# EAGLE design Fonte (EAGLE 9.4.1)
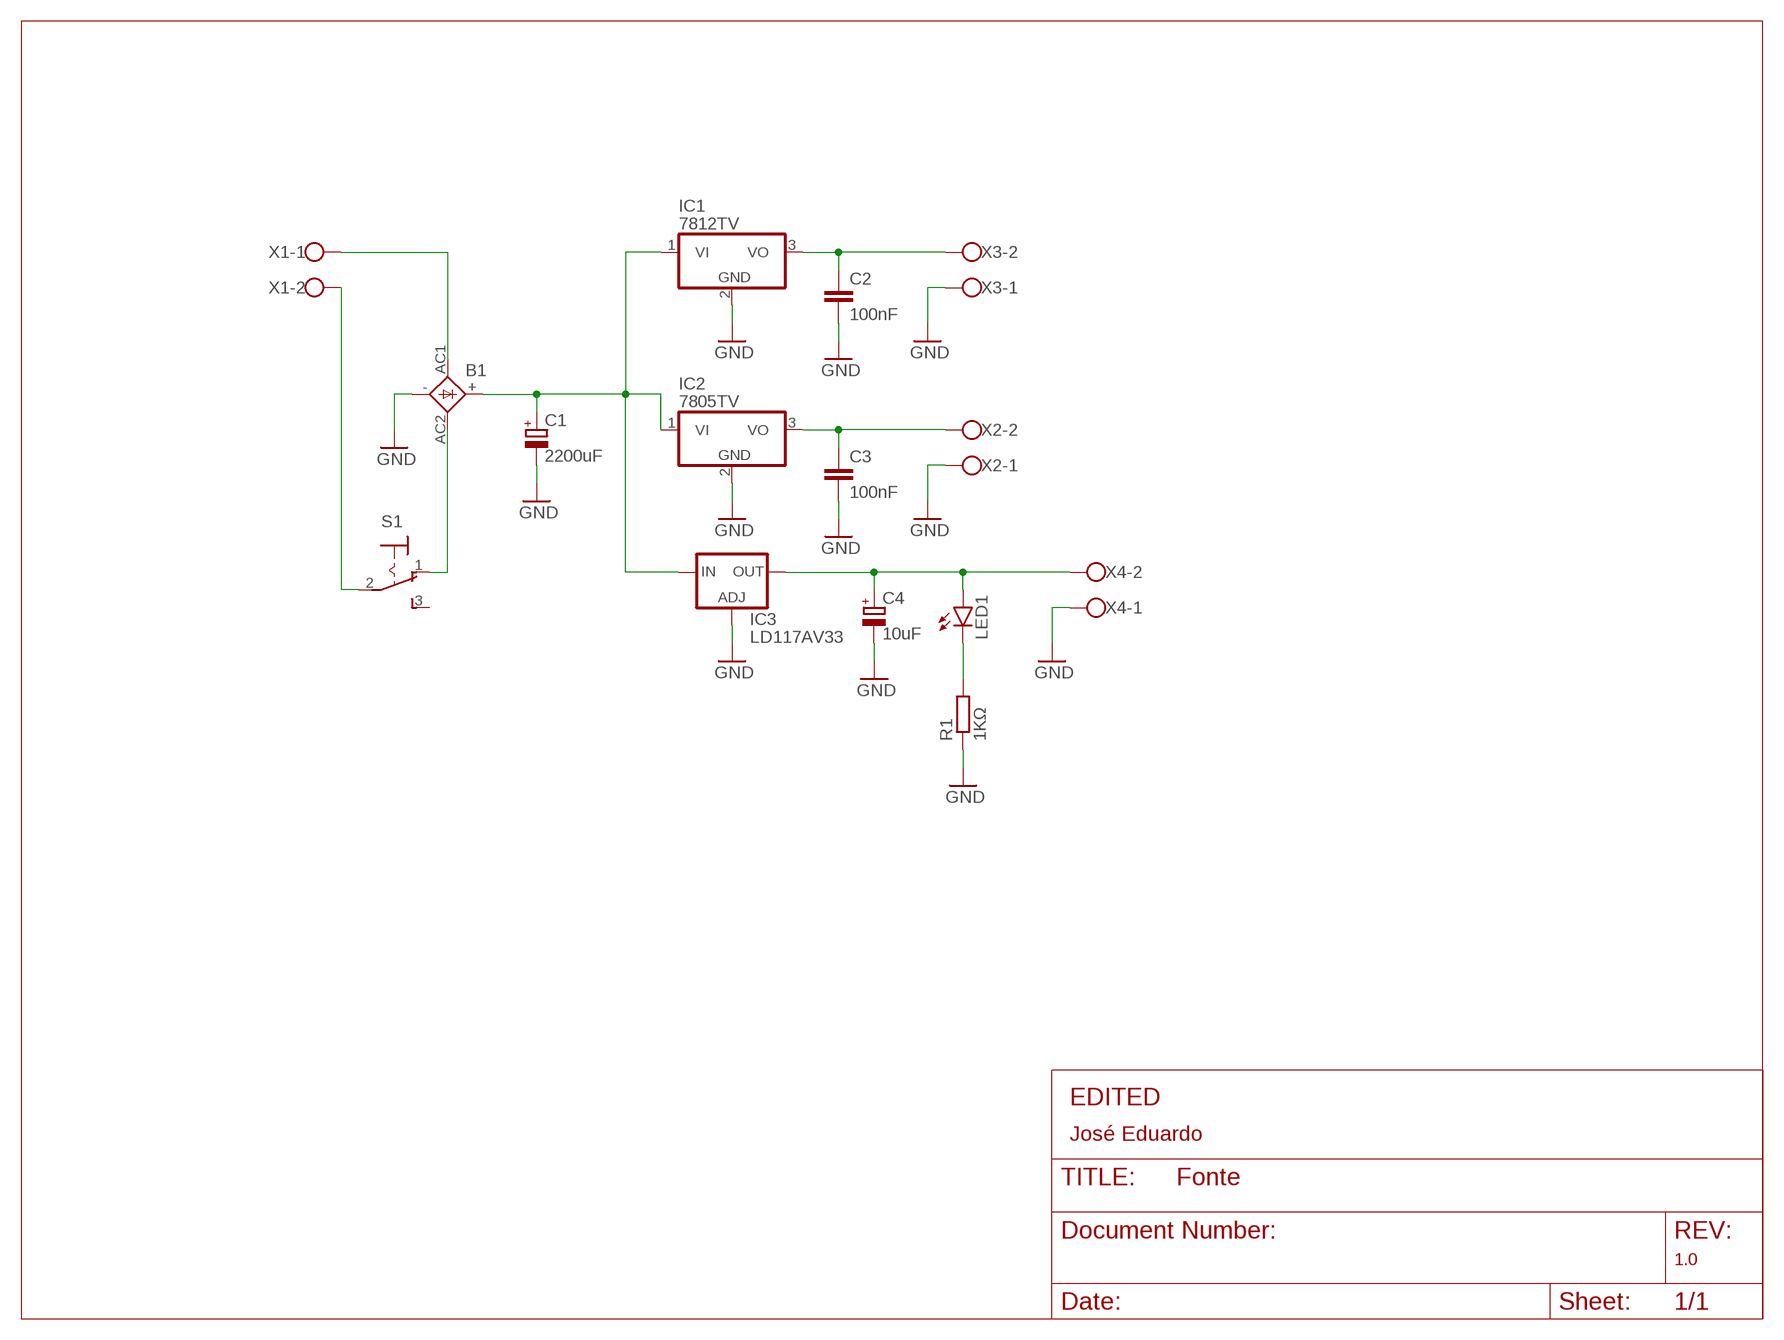
[diagram p0: schematic, sheet 1]
FRAME1 (LETTER_L): EDIT: José Eduardo; REV: 1.0

## Parts
B1  2KBB  [2KBB]
C1  2200uF  CPOL-EUE5-13  [E5-13]
C2  100nF  C-EU025-024X044  [C025-024X044]
C3  100nF  C-EU025-024X044  [C025-024X044]
C4  10uF  CPOL-EUE1.8-4  [E1,8-4]
IC1  7812TV  [TO220V]
IC2  7805TV  [TO220V]
IC3  LD117AV33  [TO220S]
LED1  LED5MM  [LED5MM]
R1  1KΩ  R-EU_0207/10  [0207/10]
S1  M9040P  [M9040P]
X1  W237-102  [W237-102]
X2  W237-102  [W237-102]
X3  W237-102  [W237-102]
X4  W237-102  [W237-102]

## Nets
3.3V: C4.+ IC3.2(OUT) LED1.A X4.2
5V: C2.1 IC1.3(VO) X3.2
12V: C3.1 IC2.3(VO) X2.2
AC1: B1.AC1 X1.1
AC2: S1.2(P) X1.2
CHAVE: B1.AC2 S1.1(O)
GND: B1.- C1.- C2.2 C3.2 C4.- IC1.2(GND) IC2.2(GND) IC3.1(ADJ) R1.1 X2.1 X3.1 X4.1
LED: LED1.K(C) R1.2
MAIN: B1.+ C1.+ IC1.1(VI) IC2.1(VI) IC3.3(IN)
Unconnected: S1.3(S)

## Library data of the parts
B1 = rectifier:2KBB: RECTIFIER grid 3 x 5 mm
C1 = resistor:CPOL-EU: POLARIZED CAPACITOR, European symbol
C2 C3 = rcl:C-EU: CAPACITOR, European symbol; SPICEPREFIX: C
C4 = rcl:CPOL-EU: POLARIZED CAPACITOR, European symbol; SPICEPREFIX: C
IC1 IC2 = linear:78*: Positive VOLTAGE REGULATOR Source: http://cache.national.com/ds/LM/LM78L05.pdf http://www.fairchildsemi.com/ds/LM/LM7805.pdf
IC3 = v-reg:LD117A?*: Low drop fixed and adjustable positive voltage regulators 1 A Source: http://www.st.com/stonline/products/literature/ds/7194/ld1117axx.pdf
LED1 = led:LED: LED OSRAM: - CHIPLED LG R971, LG N971, LY N971, LG Q971, LY Q971, LO R971, LY R971 LH N974, LH R974 LS Q976, LO Q976, LY Q976 LO Q996 - Hyper CHIPLED LW Q18S LB Q993, LB Q99A, LB R99A - SideLED LS A670, LO A670, LY A670, LG A670, LP A670 LB A673, LV A673, LT A673, LW A673 LH A674 LY A675 LS A676, LA A676, LO A676, LY A676, LW A676 LS A679, LY A679, LG A679 - Hyper Micro SIDELED® LS Y876, LA Y876, LO Y876, LY Y876 LT Y87S - SmartLED LW L88C, LW L88S LB L89C, LB L89S, LG L890 LS L89K, LO L89K, LY L89K LS L896, LA L896, LO L896, LY L896 - TOPLED LS T670, LO T670, LY T670, LG T670, LP T670 LSG T670, LSP T670, LSY T670, LOP T670, LYG T670 LG T671, LOG T671, LSG T671 LB T673, LV T673, LT T673, LW T673 LH T674 LS T676, LA T676, LO T676, LY T676, LB T676, LH T676, LSB T676, LW T676 LB T67C, LV T67C, LT T67C, LS T67K, LO T67K, LY T67K, LW E67C LS E67B, LA E67B, LO E67B, LY E67B, LB E67C, LV E67C, LT E67C LW T67C LS T679, LY T679, LG T679 LS T770, LO T770, LY T770, LG T770, LP T770 LB T773, LV T773, LT T773, LW T773 LH T774 LS E675, LA E675, LY E675, LS T675 LS T776, LA T776, LO T776, LY T776, LB T776 LHGB T686 LT T68C, LB T68C - Hyper Mini TOPLED® LB M676 - Mini TOPLED Santana® LG M470 LS M47K, LO M47K, LY M47K Source: http://www.osram.convergy.de LUXEON: - LUMILED® LXK2-PW12-R00, LXK2-PW12-S00, LXK2-PW14-U00, LXK2-PW14-V00 LXK2-PM12-R00, LXK2-PM12-S00, LXK2-PM14-U00 LXK2-PE12-Q00, LXK2-PE12-R00, LXK2-PE12-S00, LXK2-PE14-T00, LXK2-PE14-U00 LXK2-PB12-K00, LXK2-PB12-L00, LXK2-PB12-M00, LXK2-PB14-N00, LXK2-PB14-P00, LXK2-PB14-Q00 LXK2-PR12-L00, LXK2-PR12-M00, LXK2-PR14-Q00, LXK2-PR14-R00 LXK2-PD12-Q00, LXK2-PD12-R00, LXK2-PD12-S00 LXK2-PH12-R00, LXK2-PH12-S00 LXK2-PL12-P00, LXK2-PL12-Q00, LXK2-PL12-R00 Source: www.luxeon.com KINGBRIGHT: KA-3528ASYC Source: www.kingbright.com
R1 = rcl:R-EU_: RESISTOR, European symbol; SPICEPREFIX: R
S1 = switch:M9040P: TOGGLE SWITCH Marquardt
X1-X4 = con-wago-500:W237-102: WAGO SCREW CLAMP; MPN: 237-102; OC_FARNELL: unknown; OC_NEWARK: 70K9898

## Net classes
0 MAIN: width 0.61 mm, clearance 0.61 mm
1 GENERIC: width 0.66 mm, clearance 0.66 mm

## Board
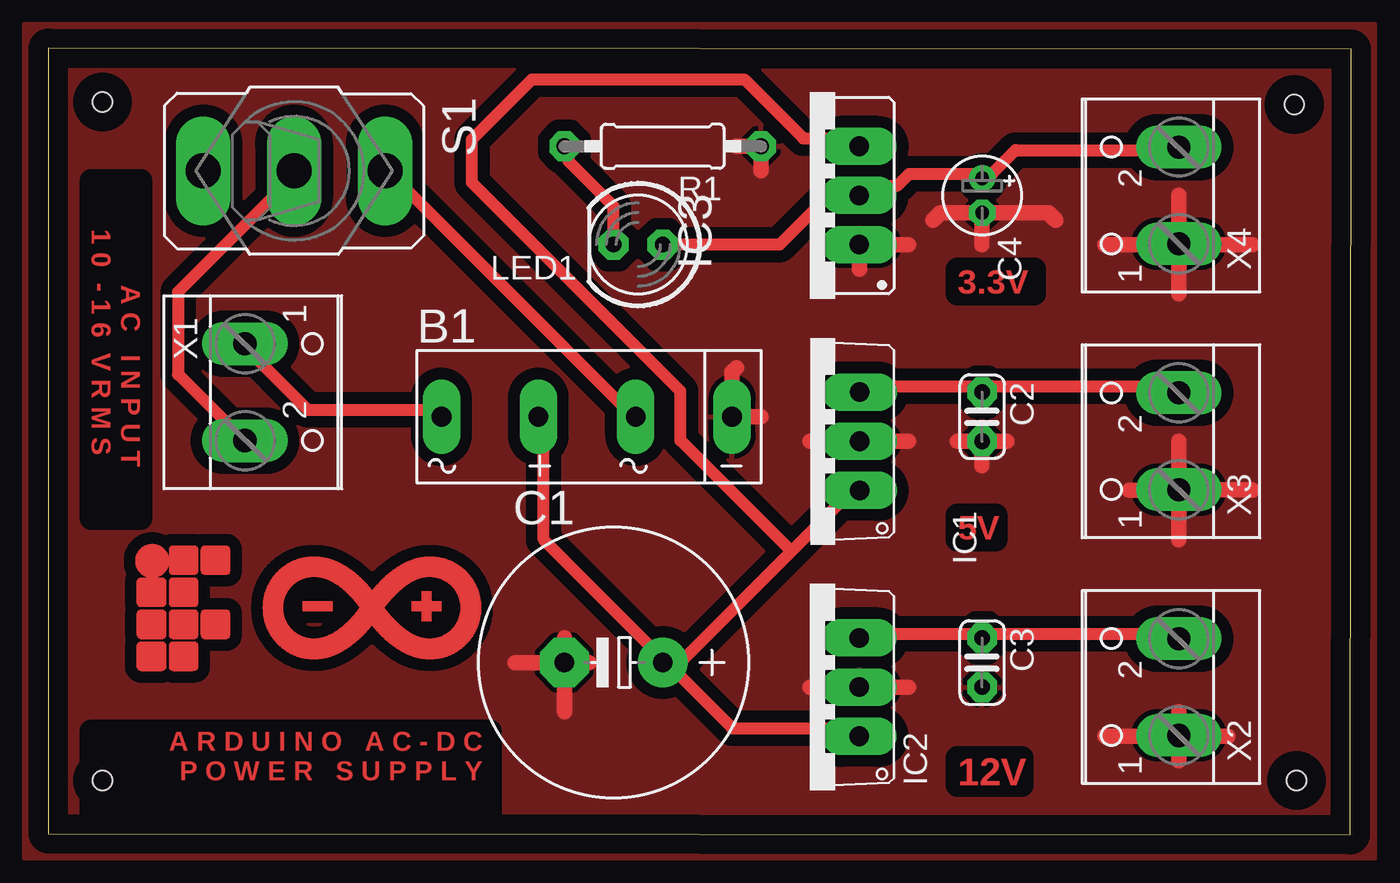
[diagram p1: board, top side]

Size 67.33 x 40.62 mm. Coordinates in mm from the lower left corner, seen from the top.
Outline: 0,0.05 67.29,0 67.33,40.56 0,40.62 0,0.05
Copper layers (1*16): Top 0.035mm / dielectric 1.5mm / Bottom 0.035mm
Design rules "default *": minimum track width 6mil, minimum drill 0.35mm, track to track 6mil, track to pad 6mil, pad to pad 6mil, via to via 6mil, smd to smd 6mil, copper to edge 40mil, drill to drill 6mil, minimum pad ring 10mil, minimum via ring 8mil, stop-mask expansion 4mil, vias tented up to drill 0mil, thermal gap 10mil
Holes 1 mm at 2.79,37.85 2.79,2.79 64.52,2.79 64.39,37.72

### Footprints (pad centres in the part's own frame; a part is rotated, then mirrored left to right if it is on the bottom)
2KBB = drill 1.016 long: + -2.616,0; - 7.391,0; AC1 -7.62,0; AC2 2.413,0
E5-13 = drill 1.016 pad 2.54: + -2.54,0 | drill 1.016 pad 2.54 octagon: - 2.54,0
C025-024X044 = drill 0.813 octagon: 1 -1.27,0; 2 1.27,0
E1,8-4 = drill 0.711 pad 1.168: + -0.889,0 | drill 0.711 pad 1.168 octagon: - 0.889,0
TO220V = drill 1.016 long: 1 -2.54,-2.54; 2 0,-2.54; 3 2.54,-2.54
TO220S = drill 1.016 long: 1 -2.54,-2.54; 2 0,-2.54; 3 2.54,-2.54
LED5MM = drill 0.813 octagon: A -1.27,0; K 1.27,0
0207/10 = drill 0.813 octagon: 1 -5.08,0; 2 5.08,0
M9040P = drill 1.803 long: 1 0,4.699; 2 0,0; 3 0,-4.699
W237-102 = drill 1.194 long: 1 -2.5,-1.27; 2 2.5,-1.27

### Placement (x,y rotation side)
B1  27.94,21.59 0 top
C1  29.21,8.89 180 top
C2  48.26,21.59 270 top
C3  48.26,8.89 270 top
C4  48.26,33.02 270 top
IC1  39.38,20.32 90 top
IC2  39.37,7.62 90 top
IC3  39.37,33.02 90 top
LED1  30.48,30.48 180 top
R1  31.75,35.56 180 top
S1  12.7,34.29 270 top
X1  11.43,22.86 270 top
X2  57.15,7.62 90 top
X3  57.15,20.32 90 top
X4  57.15,33.02 90 top

### Tracks (layer width: path | path; a pad name or v marks a point on that pad's centre or on a via)
3.3V
  Top 0.61: LED1.A 37.8,30.48 40.23,32.92 41.45,32.92 IC3.2 42.06,33.53 43.89,33.53 44.5,34.14 48.16,34.14 C4.+ 48.77,34.14 49.99,35.36 57.91,35.36 X4.2
5V
  Top 0.61: IC1.3 42.06,23.16 48.16,23.16 C2.1 48.77,23.16 57.91,23.16 X3.2
12V
  Top 0.61: IC2.3 42.06,10.36 48.16,10.36 C3.1 48.77,10.36 57.91,10.36 X2.2
AC1
  Top 0.61: B1.AC1 20.12,21.95 13.41,21.95 10.36,24.99 X1.1
AC2
  Top 0.61: X1.2 9.75,20.73 6.71,23.77 6.71,28.04 12.8,34.14 S1.2
CHAVE
  Top 0.61: B1.AC2 29.87,21.95 17.68,34.14 S1.1
GND
  Top 0.813: 35.56,35.56 R1.1 36.83,34.29 | 41.91,29.21 IC3.1 44.45,30.48 | IC1.2 40.64,20.32 | IC1.2 43.18,20.32 | IC1.2 44.45,20.32 | IC1.2 39.37,20.32 | 35.56,24.13 35.33,23.9 B1.- 36.83,21.59 | C1.- 26.67,6.35 | C1.- 24.13,8.89 | C1.- 26.67,10.16 | C1.- 27.94,8.89 | 39.37,7.62 IC2.2 44.45,7.62 | X2.1 58.42,3.81 | X2.1 58.42,6.35 | X2.1 58.46,5.08 60.96,5.08 | X2.1 58.38,5.08 54.61,5.08 | X3.1 58.42,15.24 | X3.1 58.38,17.78 55.88,17.78 | X3.1 58.42,20.32 | X3.1 62.19,17.82 62.23,17.78 | 48.26,19.05 C2.2 | 46.99,20.32 C2.2 | C2.2 49.53,20.32 | C4.- 48.26,30.48 | C4.- 46.1,32.13 45.72,31.75 | C4.- 51.69,32.13 52.07,31.75 | X4.1 58.42,27.94 | X4.1 58.38,30.48 54.61,30.48 | X4.1 58.46,30.48 62.23,30.48 | X4.1 58.42,33.02
  pour Top (isolate 0.381): -1.27,-1.27 -1.27,41.91 68.58,41.91 68.58,-1.27
LED
  Top 0.61: R1.2 26.87,35.36 26.87,34.8 29.21,32.46 LED1.K
MAIN
  Top 0.61: B1.+ 25.6,21.34 25.6,15.24 31.7,9.14 C1.+ 32.31,8.53 | 32.31,8.53 35.36,5.49 41.45,5.49 IC2.1 | 32.31,8.53 38.41,14.63 | 38.41,14.63 41.45,17.68 IC1.1 | 38.41,14.63 32.66,20.37 32.66,22.91 21.9,33.68 21.9,35.92 24.99,39.01 35.97,39.01 39.01,35.97 41.45,35.97 IC3.3
(copper drawn outside any net)
  shapes: Top area x7693

### Text on the board
Top: 3.3V | A C I N P U T / 1 0 - 1 6 V R M S | 5V | A R D U I N O A C - D C / P O W E R S U P P L Y | 12V